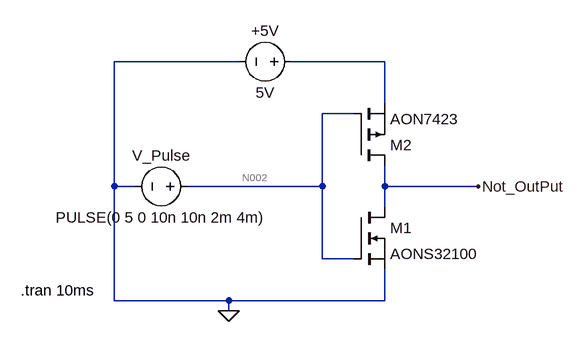
[diagram p0: schematic Porte Inverseuse.asc]
Porte Inverseuse.asc, the LTspice schematic file:
Version 4
SHEET 1 880 680
WIRE 16 48 -176 48
WIRE 240 48 96 48
WIRE 240 112 240 48
WIRE 192 128 144 128
WIRE -176 240 -176 48
WIRE -144 240 -176 240
WIRE 144 240 144 128
WIRE 144 240 -64 240
WIRE 240 240 240 208
WIRE 384 240 240 240
WIRE 240 272 240 240
WIRE 144 352 144 240
WIRE 192 352 144 352
WIRE -176 416 -176 240
WIRE 0 416 -176 416
WIRE 240 416 240 368
WIRE 240 416 0 416
WIRE 0 432 0 416
FLAG 384 240 Not_OutPut
FLAG 0 432 0
SYMBOL voltage -48 240 R90
WINDOW 0 -32 56 VBottom 2
WINDOW 3 32 56 VTop 2
WINDOW 123 0 0 Left 0
WINDOW 39 0 0 Left 0
SYMATTR InstName V_Pulse
SYMATTR Value PULSE(0 5 0 10n 10n 2m 4m)
SYMBOL nmos 192 272 R0
SYMATTR InstName M1
SYMATTR Value AONS32100
SYMBOL voltage 112 48 R90
WINDOW 0 -32 56 VBottom 2
WINDOW 3 32 56 VTop 2
WINDOW 123 0 0 Left 0
WINDOW 39 0 0 Left 0
SYMATTR InstName +5V
SYMATTR Value 5V
SYMBOL pmos 192 208 M180
SYMATTR InstName M2
SYMATTR Value AON7423
TEXT -320 400 Left 2 !.tran 10ms

The netlist it stands for:
* Porte Inverseuse.asc
V_Pulse N002 0 PULSE(0 5 0 10n 10n 2m 4m)
M1 Not_OutPut N002 0 0 AONS32100
V§+5V N001 0 5V
M2 Not_OutPut N002 N001 N001 AON7423
.model NMOS NMOS
.model PMOS PMOS
.lib standard.mos
.tran 10ms
.backanno
.end

* Results of the author's LTspice run, read from the files saved beside the schematic
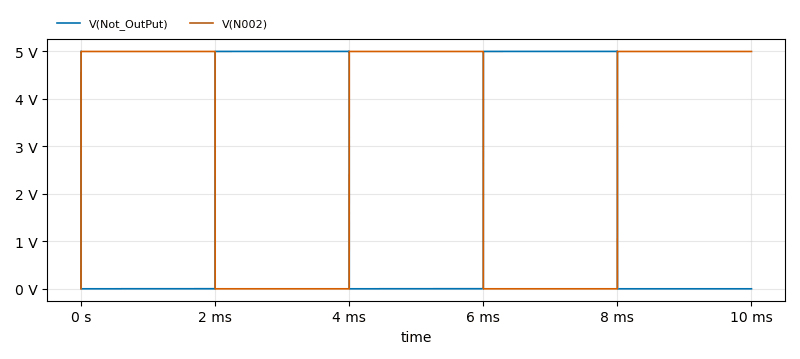
[diagram p1: Transient Analysis of Porte Inverseuse.asc, plotted from the saved traces]
* Transient Analysis, 1 run:
*   V(Not_OutPut): min -926.8 µV, max 5.005 V, average 2 V, rms 3.162 V, last 0 V
*   V(N002): min 0 V, max 5 V, average 3 V, rms 3.873 V, last 5 V